# Altium schematic sheet ADC.SchDoc
size OrCAD A
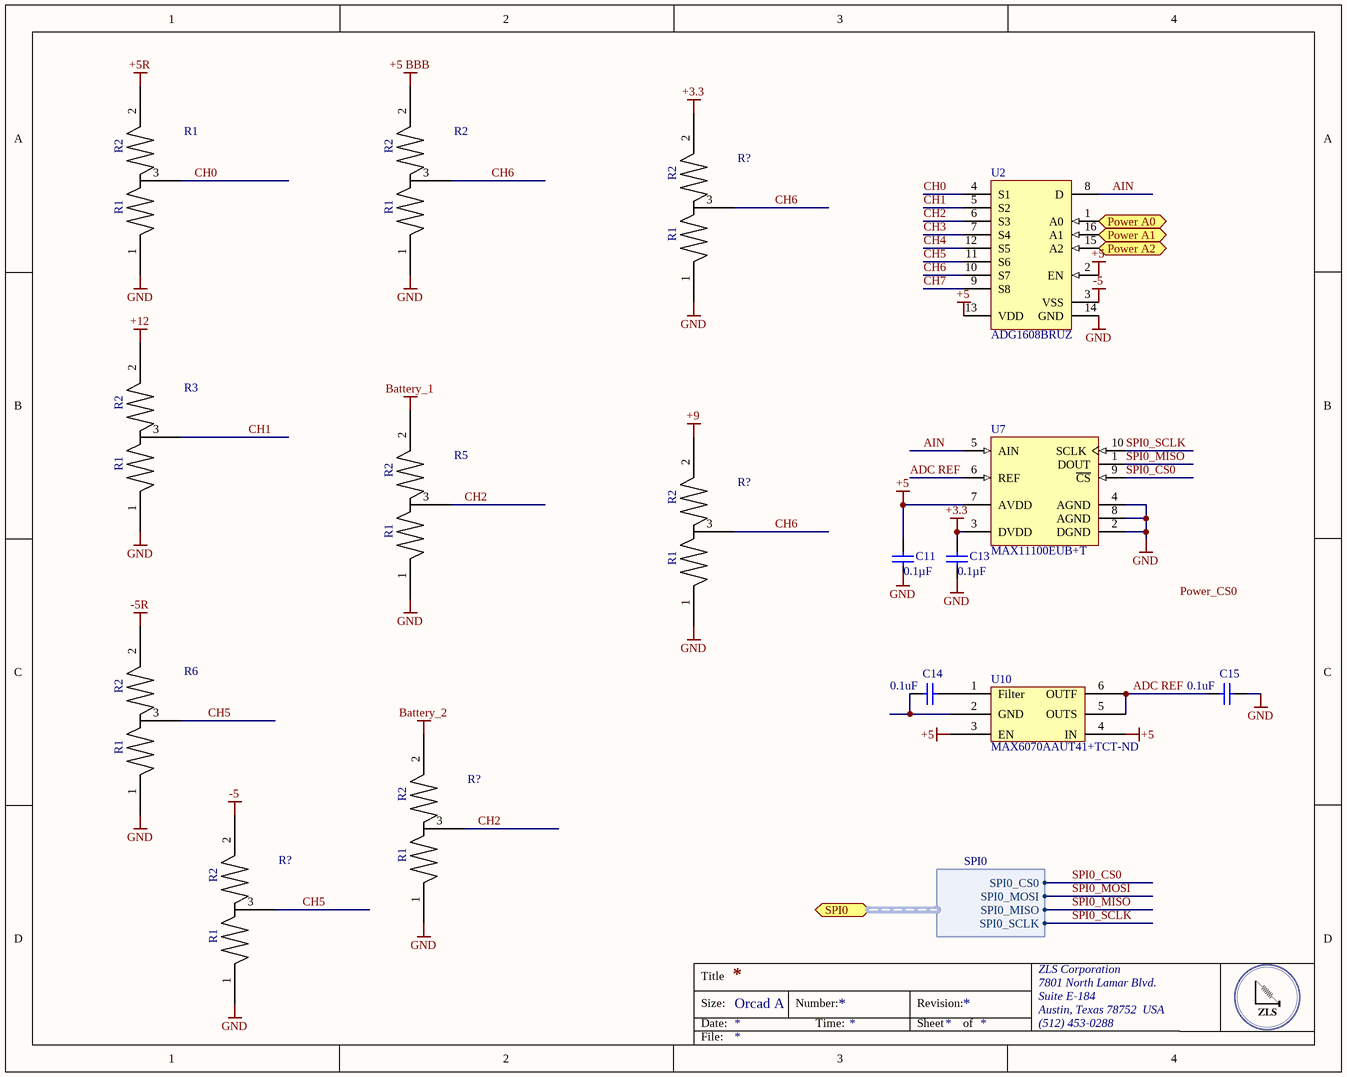
[diagram p0: ADC.SchDoc]

## Parts
(Parts that share a designator on the sheet are numbered #1, #2 ... from top to bottom, then left to right.)
C11  Capacitance: 0.1µF  [CAPC0805(2012)145_N]  (hidden comment: CAP CER 0.1UF 25V X7R 0805)
C13  Capacitance: 0.1µF  [CAPC0805(2012)145_N]  (hidden comment: CAP CER 0.1UF 25V X7R 0805)
C14  0.1uF  [CAPC0402(1005)60_L]
C15  0.1uF  [CAPC0402(1005)60_L]
R1  MPM  [SOT95P230X102-3N-MPM]  (value not drawn)
R2  MPM  [SOT95P230X102-3N-MPM]  (value not drawn)
R3  MPM  [SOT95P230X102-3N-MPM]  (value not drawn)
R5  MPM  [SOT95P230X102-3N-MPM]  (value not drawn)
R6  MPM  [SOT95P230X102-3N-MPM]  (value not drawn)
R?#1  MPM  [SOT95P230X102-3N-MPM]  (value not drawn)
R?#2  MPM  [SOT95P230X102-3N-MPM]  (value not drawn)
R?#3  MPM  [SOT95P230X102-3N-MPM]  (value not drawn)
R?#4  MPM  [SOT95P230X102-3N-MPM]  (value not drawn)
U2  ADG1608BRUZ  [ADI-RU-16_M]
U7  MAX11100EUB+T  [U10+2_L]
U10  Supplier Part Number 1: MAX6070AAUT41+TCT-ND  [SOT95P280X445-6N]  (hidden comment: MAX6070AAUT41+T)

## Ports
Power A0, Power A1, Power A2, SPI0 (harness SPI0)

## Harnesses
SPI0: SPI0_CS0, SPI0_MOSI, SPI0_MISO, SPI0_SCLK

## Nets
+3.3: C13.1 R?#1.2 U7.3(DVDD)
+5: C11.1 U2.2(EN) U2.13(VDD) U7.7(AVDD) U10.3(EN) U10.4(IN)
+5 BBB: R2.2
+5R: R1.2
+9: R?#2.2
+12: R3.2
-5: R?#4.2 U2.3(VSS)
-5R: R6.2
Battery_1: R5.2
Battery_2: R?#3.2
GND: C13.2 C15.1 R1.1 R2.1 R3.1 R5.1 R6.1 R?#1.1 R?#2.1 R?#3.1 R?#4.1 U2.14(GND) U7.2(DGND) U7.4(AGND) U7.8(AGND)
ADC REF: C15.2 U7.6(REF) U10.5(OUTS) U10.6(OUTF)
AIN: U2.8(D) U7.5(AIN)
CH0: R1.3 U2.4(S1)
CH1: R3.3 U2.5(S2)
CH2: R5.3 R?#3.3 U2.6(S3)
CH3: U2.7(S4)
CH4: U2.12(S5)
CH5: R6.3 R?#4.3 U2.11(S6)
CH6: R2.3 R?#1.3 R?#2.3 U2.10(S7)
CH7: U2.9(S8)
Power A0: U2.1(A0) ; port Power A0
Power A1: U2.16(A1) ; port Power A1
Power A2: U2.15(A2) ; port Power A2
SPI0_CS0: U7.9(~{CS}) ; port SPI0.SPI0_CS0
SPI0_MISO: U7.1(DOUT) ; port SPI0.SPI0_MISO
SPI0_MOSI: port SPI0.SPI0_MOSI
SPI0_SCLK: U7.10(SCLK) ; port SPI0.SPI0_SCLK
NetC14_1: C14.1 U10.1(Filter)
NetC14_2: C14.2 U10.2(GND)

Not connected (* = marked no-connect by the designer): C11 2

## Notes on the sheet
- Labels drawn without touching a wire or pin: GND, Power_CS0
- Title
- Size:
- Date:
- Orcad A
- Number:
- Time:
- Revision:
- Sheet
- of
- ZLS Corporation
- 7801 North Lamar Blvd.
- Suite E-184
- Austin, Texas 78752  USA
- (512) 453-0288
- File:
- (in symbol MPM) R2; R1

## Library data of the parts
C11 C13 = CMP-1036-04795-1: Manufacturer: Murata Electronics North America; Manufacturer Part Number: GRM21BR71E104KA01L; Tolerance: ±10%; Supplier 1: Digi-Key; Supplier Part Number 1: 490-1673-6-ND; RoHS: RoHS Compliant; Category: Capacitors; Stock 1: 891652; Pricing 1: 1=0.2, 10=0.145, 100=0.0683, 500=0.04788, 1000=0.03964 (USD); Packaging: Digi-Reel®; Part Status: Active; Voltage - Rated: 25V; Temperature Coefficient: X7R; Operating Temperature: -55°C ~ 125°C; Features: -; Ratings: -; Applications: General Purpose; Mounting Type: Surface Mount, MLCC; Package / Case: 0805 (2012 Metric); Size / Dimension: 0.079" L x 0.049" W (2.00mm x 1.25mm); Height - Seated (Max): -; Thickness (Max): 0.053" (1.35mm); Lead Spacing: -; Lead Style: -; ComponentLink1URL: http://www.murata.com/~/media/webrenewal/support/library/catalog/products/capacitor/mlcc/c02e.ashx; ComponentLink1Description: http://www.murata.com/~/media/webrenewal/support/library/catalog/products/capacitor/mlcc/c02e.ashx
C14 C15 = CMP-1034-00252-1: CAP CER 0.1UF 10V X7R 0402; Manufacturer: Murata Electronics North America; Manufacturer Part Number: GRM155R71A104KA01D; Tolerance: ±10%; Supplier 1: Digi-Key; Supplier Part Number 1: 490-6321-1-ND; RoHS: RoHS Compliant; Category: Capacitors; Stock 1: 2920395; Pricing 1: 1=0.1, 10=0.014, 100=0.0063, 500=0.00446, 1000=0.00351, 2500=0.00319, 5000=0.00293 (USD); Packaging: Cut Tape (CT); Part Status: Active; Voltage - Rated: 10V; Temperature Coefficient: X7R; Operating Temperature: -55°C ~ 125°C; Features: -; Ratings: -; Applications: General Purpose; Mounting Type: Surface Mount, MLCC; Package / Case: 0402 (1005 Metric); Size / Dimension: 0.039" L x 0.020" W (1.00mm x 0.50mm); Height - Seated (Max): -; Thickness (Max): 0.022" (0.55mm); Lead Spacing: -; ComponentLink1URL: http://www.murata.com/~/media/webrenewal/support/library/catalog/products/capacitor/mlcc/c02e.ashx?la=en-us; ComponentLink1Description: http://www.murata.com/~/media/webrenewal/support/library/catalog/products/capacitor/mlcc/c02e.ashx?la=en-us
U2 = CMP-0793-00136-1: 4.5 Ohm Ron, 8-Channel +/-5 V,+12 V, +5 V and +3.3 V Multiplexer, 16-pin SOP (RU-16), Tube; Manufacturer: Analog Devices; Max Analog Signal Range: 0 to Vdd; Ron (ohms): 4.4; t transition (s): 150n; Bandwidth (Hz): 40M, 40M, 37M, 34M; Code_JEDEC: MO-153AB; PackageReference: RU-16; PackageDescription: 16-Pin Thin Shrink Small Outline Package, Body 5 x 4.4 mm, Pitch 0.65 mm; ComponentLink1Description: Manufacturer URL; ComponentLink2Description: Datasheet; PartNumber: ADG1608BRUZ; Mounting Technology: Surface Mount; PackageVersion: Nov-02; ComponentLink3Description: Package Specification; DatasheetVersion: Rev. 0; Packing: Tube; ComponentLink1URL: http://www.analog.com/en/index.html; ComponentLink3URL: http:/www.analog.com/static/imported-files/packages/36244347913743854010197452789RU16.pdf; ComponentLink2URL: http://www.analog.com/static/imported-files/data_sheets/ADG1608_1609.pdf
U7 = CMP-0249-00017-1: 16-Bit, +5V, 200ksps ADC with 10uA Shutdown, 10-Pin uMAX, -40°C to +85°C, Pb-Free, Tape and Reel; DatasheetVersion: Rev 1, Jan-2012; ComponentLink3URL: http://pdfserv.maxim-ic.com/package_dwgs/21-0061.PDF; PackageReference: U10+2; ComponentLink2URL: http://datasheets.maxim-ic.com/en/ds/MAX11100.pdf; PackageVersion: revL, 2008; ComponentLink1Description: Manufacturer URL; Code_JEDEC: MO-187-BA; ComponentLink1URL: http://www.maxim-ic.com; ComponentLink3Description: Package Specification; PackageDescription: 10-Pin Micro-MAX Thin Shrink Small Outline (uSOP), 3 x 3 x 0.85 mm Body, 0.5 mm Pitch, Pb-Free; ComponentLink2Description: Datasheet
U10 = MAX6070AAUT41+T: IC VREF SERIES 4.096V SOT23; Manufacturer: Maxim Integrated; Output Type: Fixed; Tolerance: ±0.04%; Temperature Coefficient: 6ppm/°C; Noise - 0.1Hz to 10Hz: 9.6µVp-p; Noise - 10Hz to 10kHz: 9µVrms; Voltage - Input: 4.3 V ~ 5.5 V; Current - Supply: 350µA; Supplier 1: Digi-Key; Manufacturer Part Number: MAX6070AAUT41+T; RoHS: RoHS Compliant; Category: Integrated Circuits (ICs); Stock 1: 2623; Pricing 1: 1=3.41, 10=3.213, 25=2.5704, 50=2.4418, 100=2.2491, 250=2.13344, 500=2.05634 (USD); Packaging: Cut Tape (CT); Part Status: Active; Reference Type: Series; Voltage - Output (Min/Fixed): 4.096V; Operating Temperature: -40°C ~ 125°C (TA); Mounting Type: Surface Mount; Package / Case: SOT-23-6; Supplier Device Package: SOT-23-6; ComponentLink1URL: https://datasheets.maximintegrated.com/en/ds/MAX6070-MAX6071.pdf; ComponentLink1Description: https://datasheets.maximintegrated.com/en/ds/MAX6070-MAX6071.pdf